# EAGLE design Modul PCB (EAGLE 9.6.2)
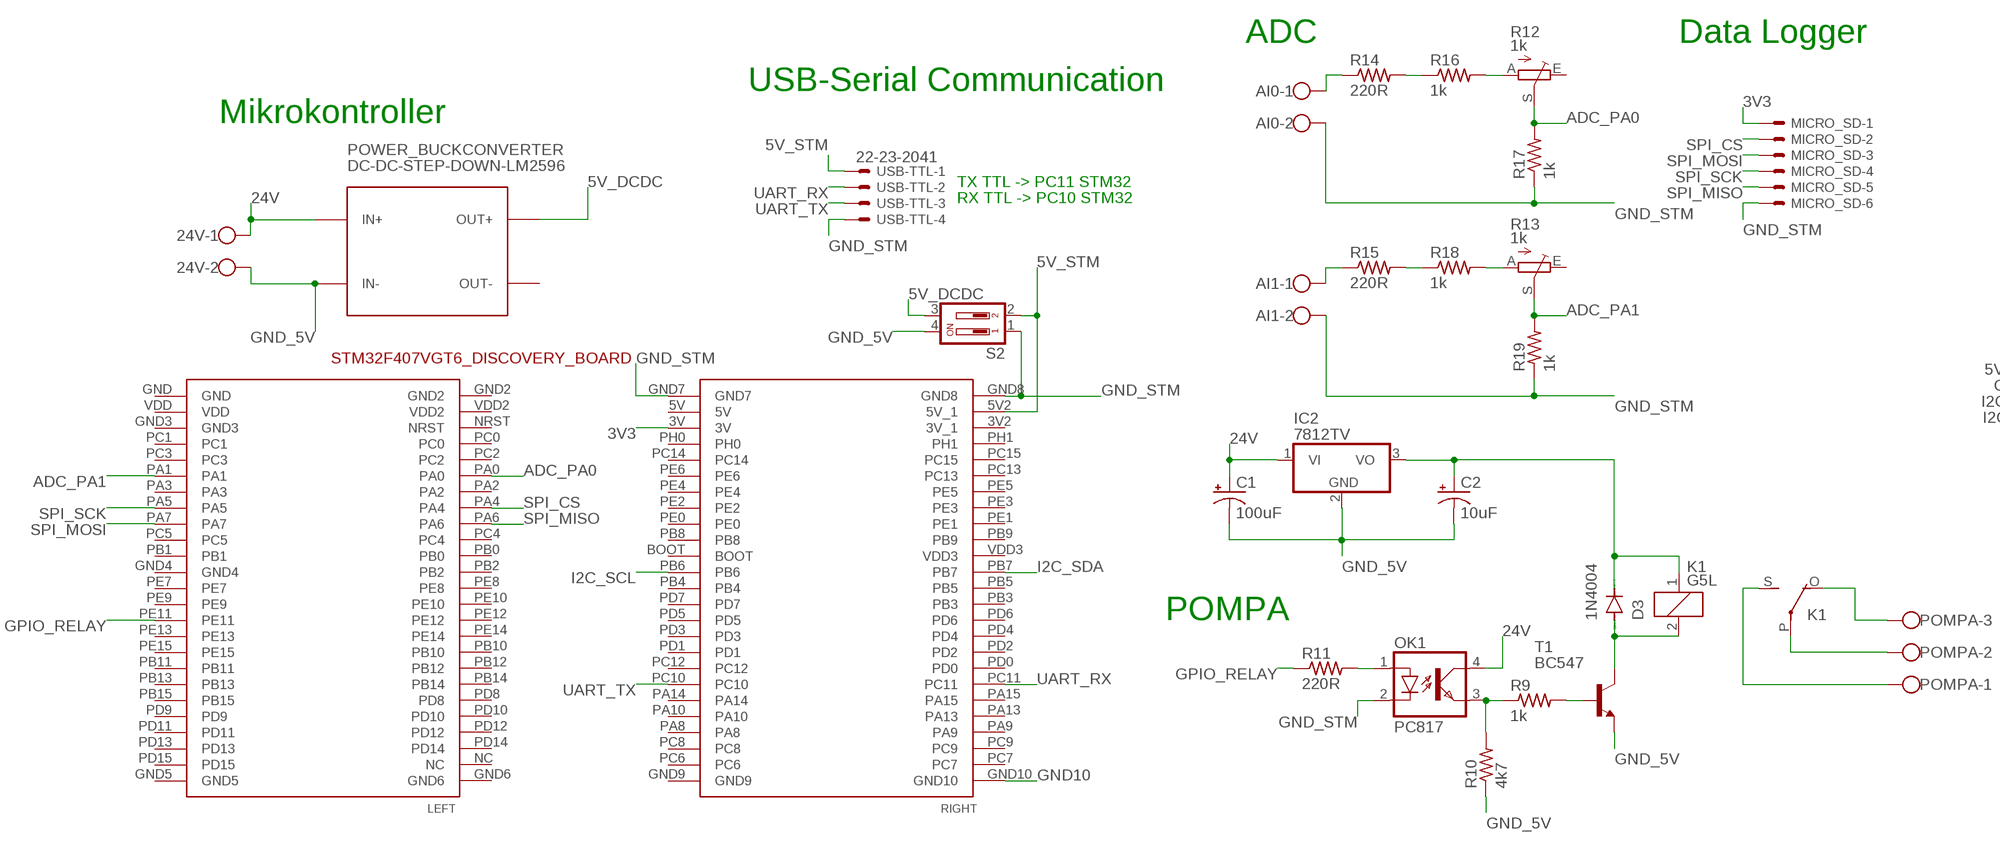
[diagram p0: schematic, sheet 1, part 1 of 2]
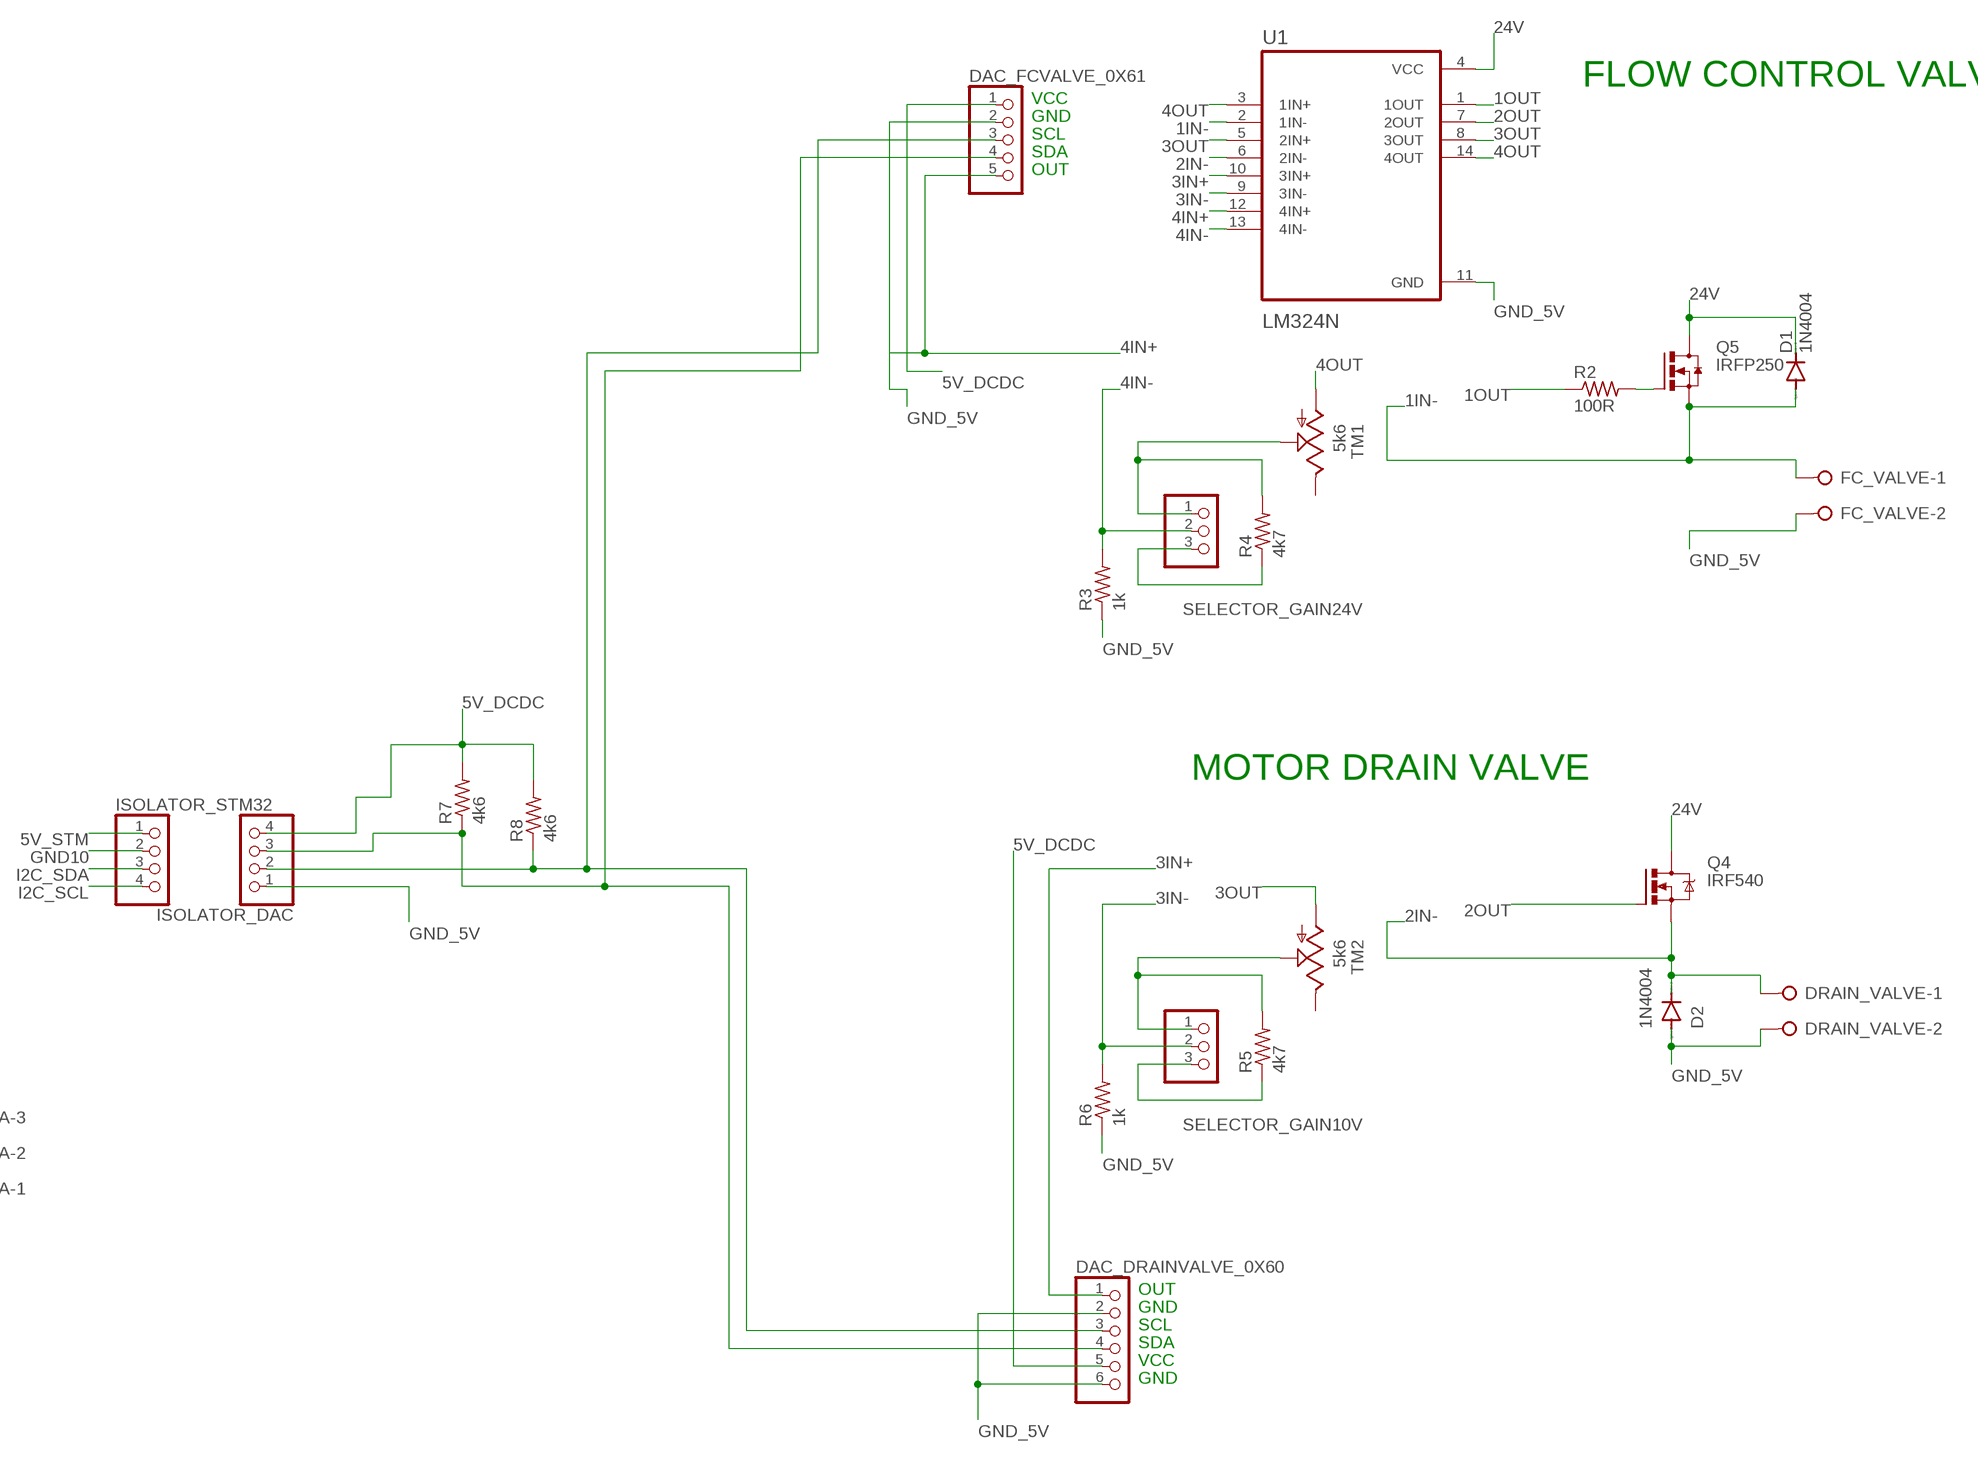
[diagram p1: schematic, sheet 1, part 2 of 2]

## Parts
24V  W237-102  [W237-102]
AI0  W237-102  [W237-102]
AI1  W237-102  [W237-102]
C1  100uF  CPOL-USE2.5-6  [E2,5-6]
C2  10uF  CPOL-USE2.5-6  [E2,5-6]
D1  1N4004  [DO41-10]
D2  1N4004  [DO41-10]
D3  1N4004  [DO41-10]
DAC_DRAINVALVE_0X60  PINHD-1X6  [1X06]
DAC_FCVALVE_0X61  PINHD-1X5  [1X05]
DRAIN_VALVE  W237-02P  [W237-132]
FC_VALVE  W237-02P  [W237-132]
IC2  7812TV  [TO220V]
ISOLATOR_DAC  PINHD-1X4  [1X04]
ISOLATOR_STM32  PINHD-1X4  [1X04]
K1  G5L  [G5LE]
MICRO_SD  22-23-2061  [22-23-2061]
OK1  PC817  [DIL04]
POMPA  W237-103  [W237-103]
POWER_BUCKCONVERTER  DC-DC-STEP-DOWN-LM2596  [DC-DC-STEP-DOWN-LM2596]
Q4  IRF540  [TO220BV]
Q5  IRFP250  [TO-247AD-V]
R2  100R  R-US_0207/10  [0207/10]
R3  1k  R-US_0207/10  [0207/10]
R4  4k7  R-US_0207/10  [0207/10]
R5  4k7  R-US_0207/10  [0207/10]
R6  1k  R-US_0207/10  [0207/10]
R7  4k6  R-US_0207/10  [0207/10]
R8  4k6  R-US_0207/10  [0207/10]
R9  1k  R-US_0207/10  [0207/10]
R10  4k7  R-US_0207/10  [0207/10]
R11  220R  R-US_0207/10  [0207/10]
R12  1k  TRIM_EU-RJ9W  [RJ9W]
R13  1k  TRIM_EU-RJ9W  [RJ9W]
R14  220R  R-US_0207/10  [0207/10]
R15  220R  R-US_0207/10  [0207/10]
R16  1k  R-US_0207/10  [0207/10]
R17  1k  R-US_0207/10  [0207/10]
R18  1k  R-US_0207/10  [0207/10]
R19  1k  R-US_0207/10  [0207/10]
S2  DS02  [DS-02]
SELECTOR_GAIN10V  PINHD-1X3  [1X03]
SELECTOR_GAIN24V  PINHD-1X3  [1X03]
STM32F407VGT6_DISCOVERY_BOARD  STM32F4-DISCOVERY  [STM32F407VG]
T1  BC547  [TO92]
TM1  5k6  TRIM  [6MM]
TM2  5k6  TRIM  [6MM]
U1  LM324N  [DIP794W45P254L1969H508Q14]
USB-TTL  22-23-2041  [22-23-2041]

## Nets
1IN-: D1.A FC_VALVE.1 Q5.S U1.2(1IN-)
1OUT: R2.1 U1.1(1OUT)
2IN-: D2.C DRAIN_VALVE.1 Q4.S U1.6(2IN-)
2OUT: Q4.G U1.7(2OUT)
3IN+: DAC_DRAINVALVE_0X60.1 U1.10(3IN+)
3IN-: R6.2 SELECTOR_GAIN10V.2 U1.9(3IN-)
3OUT: TM2.A U1.5(2IN+) U1.8(3OUT)
3V3: MICRO_SD.1 STM32F407VGT6_DISCOVERY_BOARD.3V
4IN+: DAC_FCVALVE_0X61.5 U1.12(4IN+)
4IN-: R3.2 SELECTOR_GAIN24V.2 U1.13(4IN-)
4OUT: TM1.A U1.3(1IN+) U1.14(4OUT)
5V_DCDC: DAC_DRAINVALVE_0X60.5 DAC_FCVALVE_0X61.1 ISOLATOR_DAC.4 POWER_BUCKCONVERTER.OUT+ R7.2 R8.2 S2.3
5V_STM: ISOLATOR_STM32.1 S2.2 STM32F407VGT6_DISCOVERY_BOARD.5V2(5V_1) USB-TTL.1
24V: 24V.1 C1.+ D1.C IC2.1(VI) OK1.4(COL) POWER_BUCKCONVERTER.IN+ Q4.D Q5.D U1.4(VCC)
ADC_PA0: R12.S R17.2 STM32F407VGT6_DISCOVERY_BOARD.PA0
ADC_PA1: R13.S R19.2 STM32F407VGT6_DISCOVERY_BOARD.PA1
GND10: ISOLATOR_STM32.2 STM32F407VGT6_DISCOVERY_BOARD.GND10
GND_5V: 24V.2 C1.- C2.- D2.A DAC_DRAINVALVE_0X60.2 DAC_DRAINVALVE_0X60.6 DAC_FCVALVE_0X61.2 DRAIN_VALVE.2 FC_VALVE.2 IC2.2(GND) ISOLATOR_DAC.1 POWER_BUCKCONVERTER.IN- R3.1 R6.1 R10.1 S2.4 T1.1(E) U1.11(GND)
GND_STM: AI0.2 AI1.2 MICRO_SD.6 OK1.2(C) R17.1 R19.1 S2.1 STM32F407VGT6_DISCOVERY_BOARD.GND7 STM32F407VGT6_DISCOVERY_BOARD.GND8 USB-TTL.4
GPIO_RELAY: R11.1 STM32F407VGT6_DISCOVERY_BOARD.PE11
I2C_SCL: ISOLATOR_STM32.4 STM32F407VGT6_DISCOVERY_BOARD.PB6
I2C_SDA: ISOLATOR_STM32.3 STM32F407VGT6_DISCOVERY_BOARD.PB7
N$4: Q5.G R2.2
N$9: R4.1 SELECTOR_GAIN24V.3
N$10: R4.2 SELECTOR_GAIN24V.1 TM1.S
N$11: R5.2 SELECTOR_GAIN10V.1 TM2.S
N$13: R5.1 SELECTOR_GAIN10V.3
N$16: R9.2 T1.2(B)
N$19: DAC_DRAINVALVE_0X60.4 DAC_FCVALVE_0X61.4 ISOLATOR_DAC.3 R7.1
N$20: DAC_DRAINVALVE_0X60.3 DAC_FCVALVE_0X61.3 ISOLATOR_DAC.2 R8.1
N$21: D3.A K1.2 T1.3(C)
N$23: OK1.3(EMIT) R9.1 R10.2
N$24: K1.P(2:P) POMPA.2
N$25: K1.S(2:S) POMPA.1
N$26: K1.O(2:O) POMPA.3
N$27: OK1.1(A) R11.2
N$28: AI0.1 R14.1
N$29: R14.2 R16.1
N$30: R12.A R16.2
N$32: AI1.1 R15.1
N$34: R15.2 R18.1
N$35: R13.A R18.2
N$36: C2.+ D3.C IC2.3(VO) K1.1
SPI_CS: MICRO_SD.2 STM32F407VGT6_DISCOVERY_BOARD.PA4
SPI_MISO: MICRO_SD.5 STM32F407VGT6_DISCOVERY_BOARD.PA6
SPI_MOSI: MICRO_SD.3 STM32F407VGT6_DISCOVERY_BOARD.PA7
SPI_SCK: MICRO_SD.4 STM32F407VGT6_DISCOVERY_BOARD.PA5
UART_RX: STM32F407VGT6_DISCOVERY_BOARD.PC11 USB-TTL.2
UART_TX: STM32F407VGT6_DISCOVERY_BOARD.PC10 USB-TTL.3
Unconnected: POWER_BUCKCONVERTER.OUT- R12.E R13.E STM32F407VGT6_DISCOVERY_BOARD.3V2(3V_1) STM32F407VGT6_DISCOVERY_BOARD.5V STM32F407VGT6_DISCOVERY_BOARD.BOOT STM32F407VGT6_DISCOVERY_BOARD.GND STM32F407VGT6_DISCOVERY_BOARD.GND2 STM32F407VGT6_DISCOVERY_BOARD.GND3 STM32F407VGT6_DISCOVERY_BOARD.GND4 STM32F407VGT6_DISCOVERY_BOARD.GND5 STM32F407VGT6_DISCOVERY_BOARD.GND6 STM32F407VGT6_DISCOVERY_BOARD.GND9 STM32F407VGT6_DISCOVERY_BOARD.NC STM32F407VGT6_DISCOVERY_BOARD.NRST STM32F407VGT6_DISCOVERY_BOARD.PA2 STM32F407VGT6_DISCOVERY_BOARD.PA3 STM32F407VGT6_DISCOVERY_BOARD.PA8 STM32F407VGT6_DISCOVERY_BOARD.PA9 STM32F407VGT6_DISCOVERY_BOARD.PA10 STM32F407VGT6_DISCOVERY_BOARD.PA13 STM32F407VGT6_DISCOVERY_BOARD.PA14 STM32F407VGT6_DISCOVERY_BOARD.PA15 STM32F407VGT6_DISCOVERY_BOARD.PB0 STM32F407VGT6_DISCOVERY_BOARD.PB1 STM32F407VGT6_DISCOVERY_BOARD.PB2 STM32F407VGT6_DISCOVERY_BOARD.PB3 STM32F407VGT6_DISCOVERY_BOARD.PB4 STM32F407VGT6_DISCOVERY_BOARD.PB5 STM32F407VGT6_DISCOVERY_BOARD.PB8 STM32F407VGT6_DISCOVERY_BOARD.PB9 STM32F407VGT6_DISCOVERY_BOARD.PB10 STM32F407VGT6_DISCOVERY_BOARD.PB11 STM32F407VGT6_DISCOVERY_BOARD.PB12 STM32F407VGT6_DISCOVERY_BOARD.PB13 STM32F407VGT6_DISCOVERY_BOARD.PB14 STM32F407VGT6_DISCOVERY_BOARD.PB15 STM32F407VGT6_DISCOVERY_BOARD.PC0 STM32F407VGT6_DISCOVERY_BOARD.PC1 STM32F407VGT6_DISCOVERY_BOARD.PC2 STM32F407VGT6_DISCOVERY_BOARD.PC3 STM32F407VGT6_DISCOVERY_BOARD.PC4 STM32F407VGT6_DISCOVERY_BOARD.PC5 STM32F407VGT6_DISCOVERY_BOARD.PC6 STM32F407VGT6_DISCOVERY_BOARD.PC7 STM32F407VGT6_DISCOVERY_BOARD.PC8 STM32F407VGT6_DISCOVERY_BOARD.PC9 STM32F407VGT6_DISCOVERY_BOARD.PC12 STM32F407VGT6_DISCOVERY_BOARD.PC13 STM32F407VGT6_DISCOVERY_BOARD.PC14 STM32F407VGT6_DISCOVERY_BOARD.PC15 STM32F407VGT6_DISCOVERY_BOARD.PD0 STM32F407VGT6_DISCOVERY_BOARD.PD1 STM32F407VGT6_DISCOVERY_BOARD.PD2 STM32F407VGT6_DISCOVERY_BOARD.PD3 STM32F407VGT6_DISCOVERY_BOARD.PD4 STM32F407VGT6_DISCOVERY_BOARD.PD5 STM32F407VGT6_DISCOVERY_BOARD.PD6 STM32F407VGT6_DISCOVERY_BOARD.PD7 STM32F407VGT6_DISCOVERY_BOARD.PD8 STM32F407VGT6_DISCOVERY_BOARD.PD9 STM32F407VGT6_DISCOVERY_BOARD.PD10 STM32F407VGT6_DISCOVERY_BOARD.PD11 STM32F407VGT6_DISCOVERY_BOARD.PD12 STM32F407VGT6_DISCOVERY_BOARD.PD13 STM32F407VGT6_DISCOVERY_BOARD.PD14 STM32F407VGT6_DISCOVERY_BOARD.PD15 STM32F407VGT6_DISCOVERY_BOARD.PE0 STM32F407VGT6_DISCOVERY_BOARD.PE1 STM32F407VGT6_DISCOVERY_BOARD.PE2 STM32F407VGT6_DISCOVERY_BOARD.PE3 STM32F407VGT6_DISCOVERY_BOARD.PE4 STM32F407VGT6_DISCOVERY_BOARD.PE5 STM32F407VGT6_DISCOVERY_BOARD.PE6 STM32F407VGT6_DISCOVERY_BOARD.PE7 STM32F407VGT6_DISCOVERY_BOARD.PE8 STM32F407VGT6_DISCOVERY_BOARD.PE9 STM32F407VGT6_DISCOVERY_BOARD.PE10 STM32F407VGT6_DISCOVERY_BOARD.PE12 STM32F407VGT6_DISCOVERY_BOARD.PE13 STM32F407VGT6_DISCOVERY_BOARD.PE14 STM32F407VGT6_DISCOVERY_BOARD.PE15 STM32F407VGT6_DISCOVERY_BOARD.PH0 STM32F407VGT6_DISCOVERY_BOARD.PH1 STM32F407VGT6_DISCOVERY_BOARD.VDD STM32F407VGT6_DISCOVERY_BOARD.VDD2 STM32F407VGT6_DISCOVERY_BOARD.VDD3 TM1.E TM2.E

## Notes on the sheet
- FLOW CONTROL VALVE
- VCC
- GND
- SCL
- SDA
- OUT
- ADC | Data Logger
- USB-Serial Communication
- Mikrokontroller
- TX TTL -> PC11 STM32
- RX TTL -> PC10 STM32
- MOTOR DRAIN VALVE
- POMPA
- OUT
- GND
- SCL
- SDA
- VCC
- GND

## Library data of the parts
24V AI0 AI1 = con-wago-500:W237-102: WAGO SCREW CLAMP; MPN: 237-102; OC_FARNELL: unknown; OC_NEWARK: 70K9898
C1 C2 = rcl:CPOL-US: POLARIZED CAPACITOR, American symbol; SPICEPREFIX: C
D1-D3 = diode:1N4004: DIODE general purpose rectifier, 1 A
DAC_DRAINVALVE_0X60 = pinhead:PINHD-1X6: PIN HEADER
DAC_FCVALVE_0X61 = pinhead:PINHD-1X5: PIN HEADER
DRAIN_VALVE FC_VALVE = con-wago-508:W237-02P: WAGO SREW CLAMP; OC_FARNELL: unknown; OC_NEWARK: unknown
IC2 = linear:78*: Positive VOLTAGE REGULATOR Source: http://cache.national.com/ds/LM/LM78L05.pdf http://www.fairchildsemi.com/ds/LM/LM7805.pdf
ISOLATOR_DAC ISOLATOR_STM32 = pinhead:PINHD-1X4: PIN HEADER
K1 = relay:G5L: RELAY 1 x switch, 10 A/120 V AC, 8 A/30 V ADC, Omron; OC_FARNELL: unknown; OC_NEWARK: unknown
MICRO_SD = con-molex:22-23-2061: .100" (2.54mm) Center Header - 6 Pin; MF: MOLEX; MPN: 22-23-2061; OC_FARNELL: 1462922; OC_NEWARK: 27C1933
OK1 = optocoupler:PC817: SHARP OPTO COUPLER; MPN: PC817X4J000F; OC_FARNELL: 9707727; OC_NEWARK: 97K7059
POMPA = con-wago-500:W237-103: WAGO SCREW CLAMP; MPN: 237-103; OC_FARNELL: unknown; OC_NEWARK: 18M7116
POWER_BUCKCONVERTER = diy-modules:DC-DC-STEP-DOWN-LM2596: DC/DC Step-Down Regulator based on LM2596-ADJ chip LM2596 datasheet available here: http://www.ti.com/lit/ds/symlink/lm2596.pdf Click here to find device on ebay.com <http://www.ebay.com/sch/lm2596+power+regulator>
Q4 = transistor-power:IRF540: HEXFET Power MOSFET
Q5 = transistor-power:IRFP25*: 33A/27A, 200V/150V, 0.085/0.012 Ohm, N-Channel Power MOSFET Source: Fairchild Semiconductor Corporation
R2-R11 R14-R19 = rcl:R-US_: RESISTOR, American symbol; SPICEPREFIX: R
R12 R13 = pot:TRIM_EU-: POTENTIOMETER
S2 = switch-dil:DS02: DIL/CODE SWITCH; OC_FARNELL: 9472126; OC_NEWARK: unknown
SELECTOR_GAIN10V SELECTOR_GAIN24V = pinhead:PINHD-1X3: PIN HEADER
STM32F407VGT6_DISCOVERY_BOARD = STM32F4 DISCOVERY:STM32F4-DISCOVERY: STM32F4DISCOVERY STM32F407VG Create by Jairo Reyes Email: jairo.314@hotmail.com
T1 = transistor:BC547: NPN TRANSISTOR
TM1 TM2 = adafruit:TRIM
U1 = LM324N:LM324N: Check availability <https://pricing.snapeda.com/parts/LM324N/STMicroelectronics/view-part?ref=eda>; AVAILABILITY: In Stock; DESCRIPTION: General Purpose Amplifier 4 Circuit - 14-DIP; MF: STMicroelectronics; MP: LM324N; PACKAGE: DIP-14 STMicroelectronics; PRICE: None; PURCHASE-URL: https://pricing.snapeda.com/search/part/LM324N/?ref=eda
USB-TTL = con-molex:22-23-2041: .100" (2.54mm) Center Header - 4 Pin; MF: MOLEX; MPN: 22-23-2041; OC_FARNELL: 1462920; OC_NEWARK: 38C0355

## Board
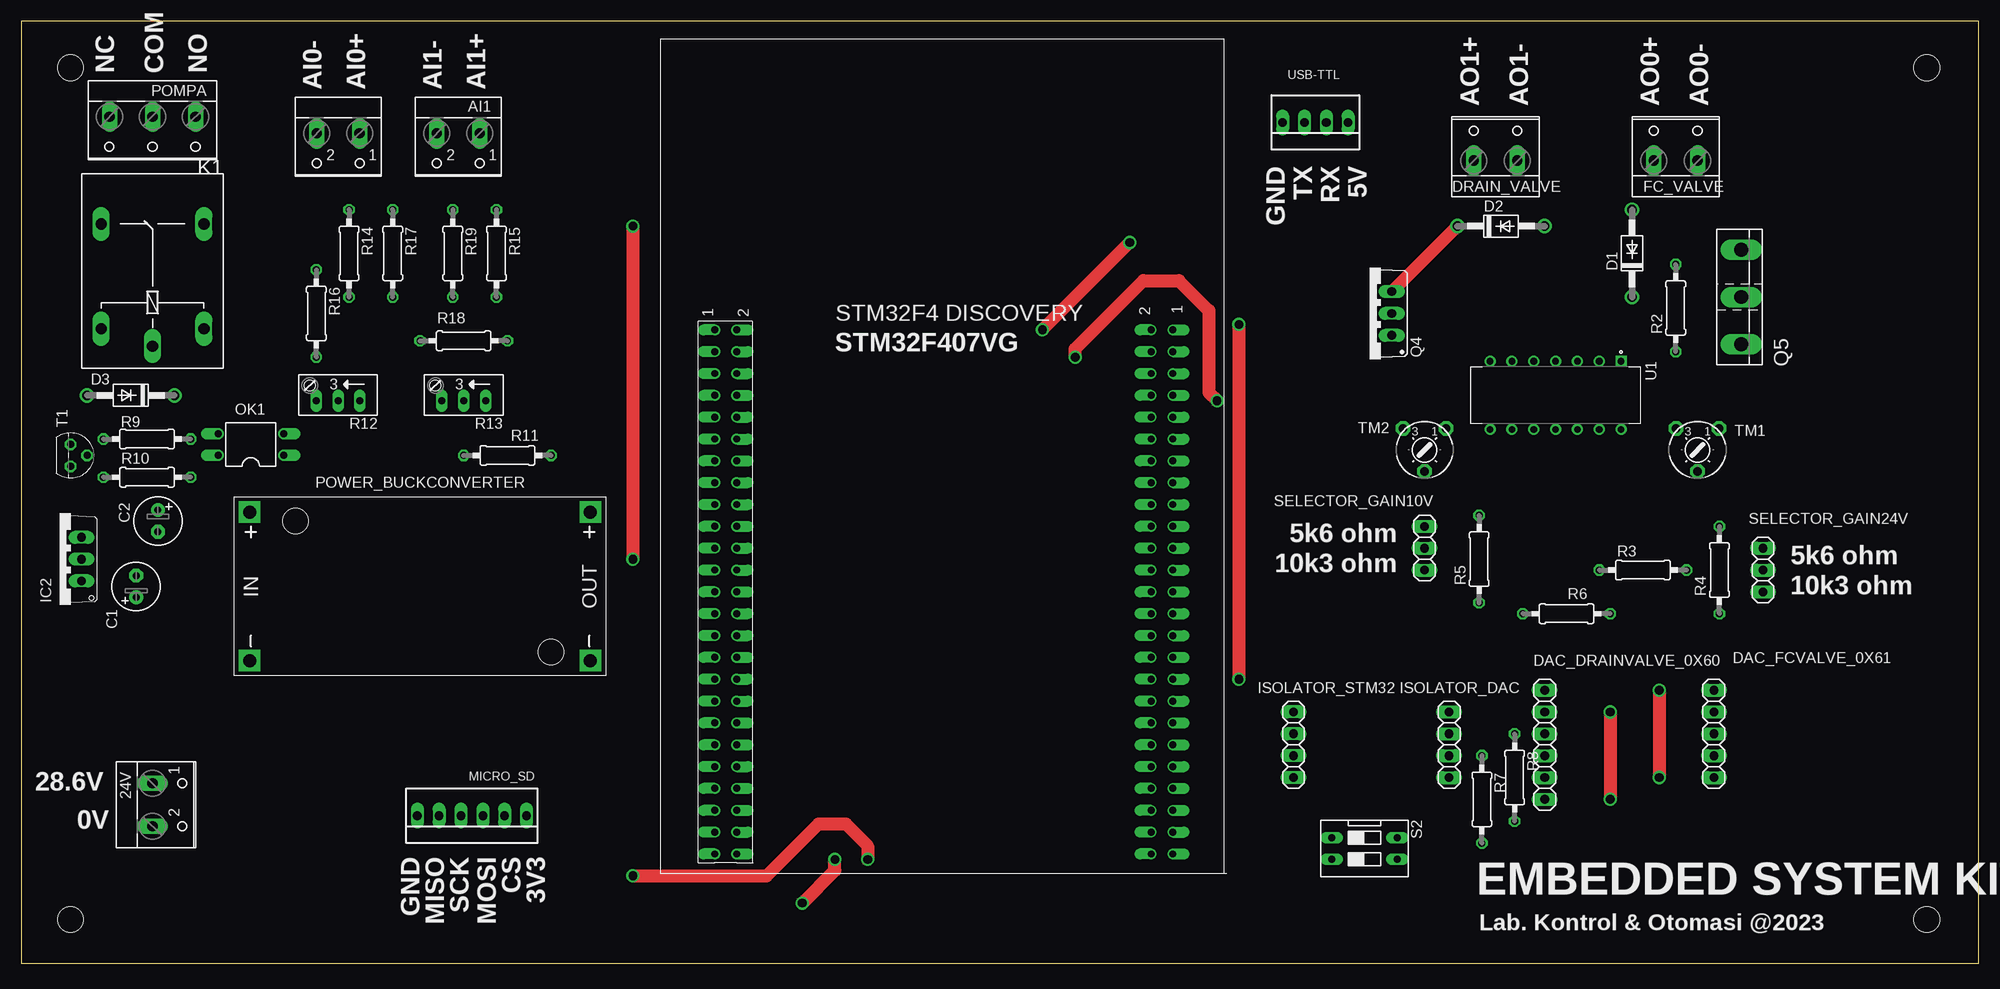
[diagram p2: board, top side]
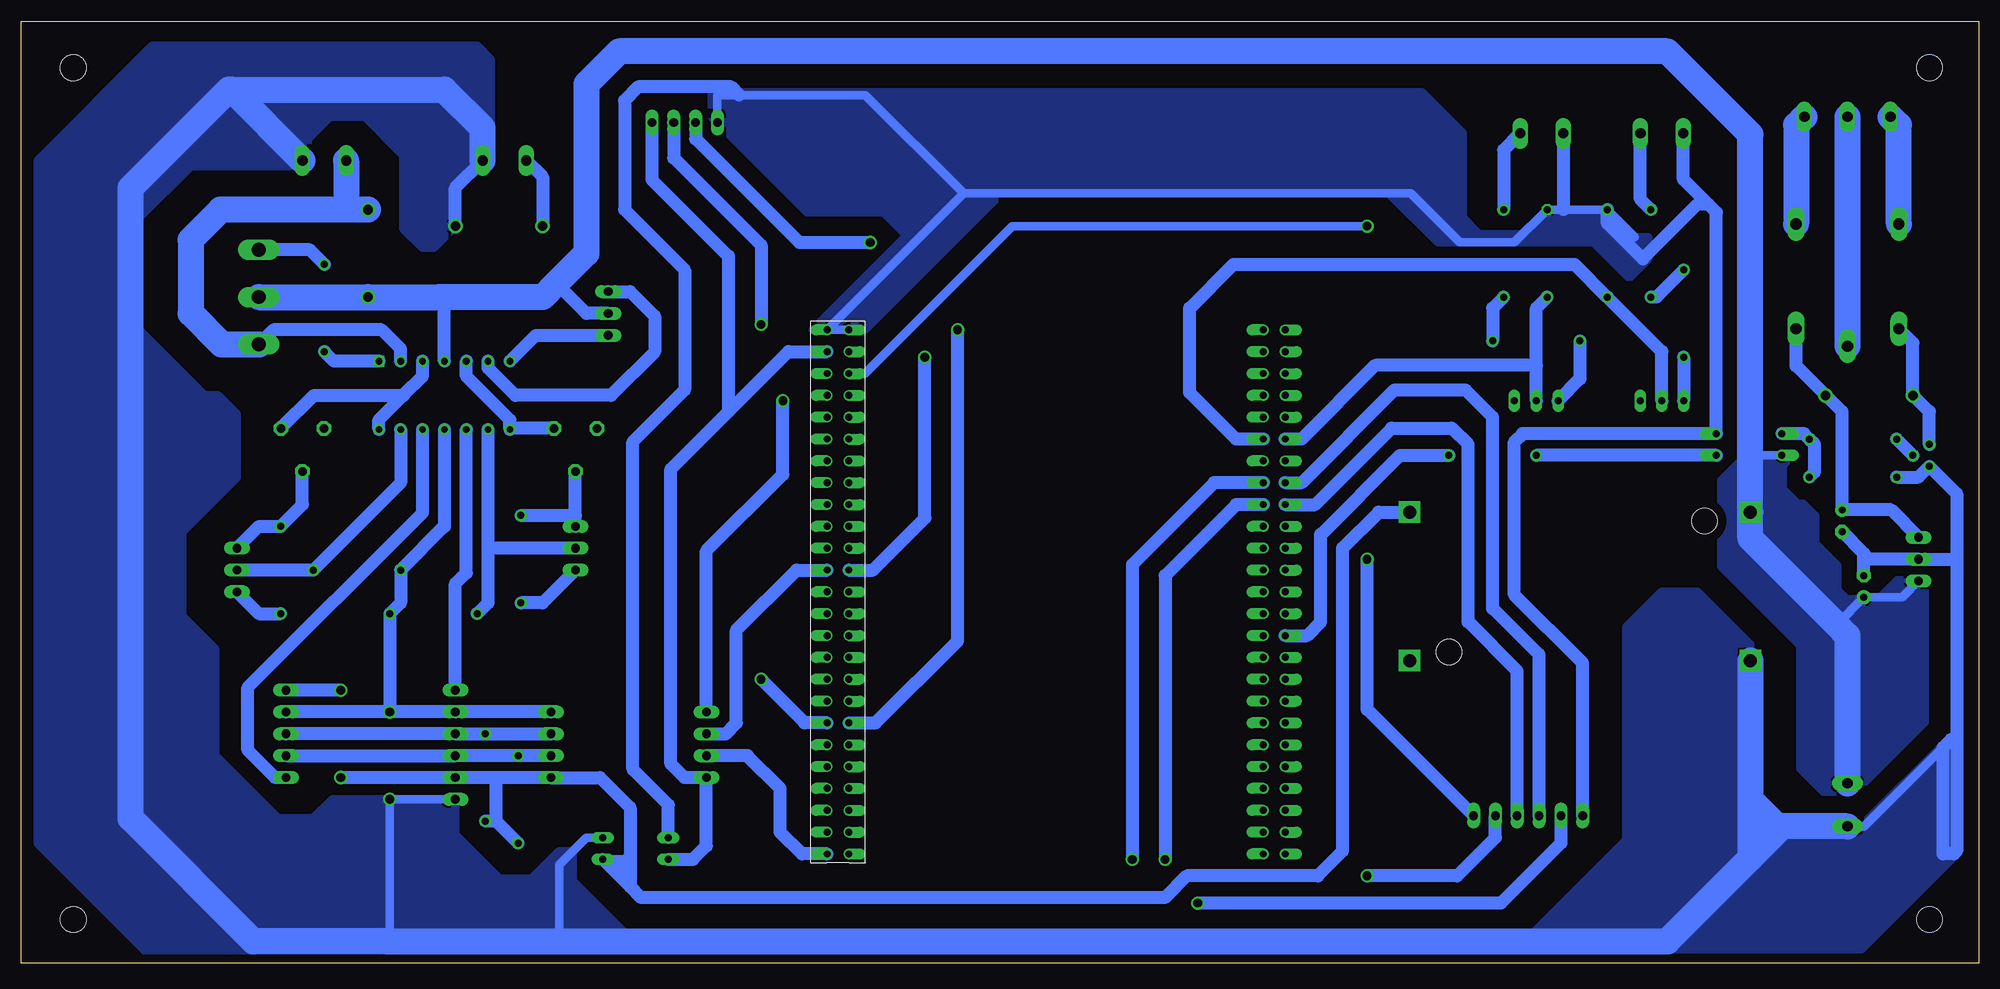
[diagram p3: board, bottom side, seen from below]

Size 227.63 x 109.52 mm. Coordinates in mm from the lower left corner, seen from the top.
Outline: 0,0 227.63,0 227.63,109.52 0,109.52 0,0
Copper layers (1*16): Top 0.035mm / dielectric 1.5mm / Bottom 0.035mm
Design rules "default": minimum track width 6mil, minimum drill 0.35mm, track to track 6mil, track to pad 6mil, pad to pad 6mil, via to via 6mil, smd to smd 6mil, copper to edge 40mil, drill to drill 6mil, minimum pad ring 10mil, minimum via ring 8mil, stop-mask expansion 4mil, vias tented up to drill 0mil, thermal gap 10mil
Holes 3 mm at 5.71,5.08 5.71,104.14 221.62,5.08 221.62,104.14

### Footprints (pad centres in the part's own frame; a part is rotated, then mirrored left to right if it is on the bottom)
W237-102 = drill 1.194 long: 1 -2.5,-1.27; 2 2.5,-1.27
E2,5-6 = drill 0.813 pad 1.6: + -1.27,0 | drill 0.813 pad 1.6 octagon: - 1.27,0
DO41-10 = drill 1.118: A 5.08,0; C -5.08,0
1X06 = drill 1.016 long: 1 -6.35,0; 2 -3.81,0; 3 -1.27,0; 4 1.27,0; 5 3.81,0; 6 6.35,0
1X05 = drill 1.016 long: 1 -5.08,0; 2 -2.54,0; 3 0,0; 4 2.54,0; 5 5.08,0
W237-132 = drill 1.194 long: 1 -2.54,-0.635; 2 2.54,-0.635
TO220V = drill 1.016 long: 1 -2.54,-2.54; 2 0,-2.54; 3 2.54,-2.54
1X04 = drill 1.016 long: 1 -3.81,0; 2 -1.27,0; 3 1.27,0; 4 3.81,0
G5LE = drill 1.321 long: 1 -7.493,-5.969; 2 -7.493,5.969; O 4.699,5.969; P -9.525,0; S 4.699,-5.969
22-23-2061 = drill 1 long: 1 -6.35,0; 2 -3.81,0; 3 -1.27,0; 4 1.27,0; 5 3.81,0; 6 6.35,0
DIL04 = drill 0.813 offset: 1 -1.27,-3.81; 2 1.27,-3.81; 3 1.27,3.81; 4 -1.27,3.81
W237-103 = drill 1.194 long: 1 -5,-1.29; 2 0,-1.29; 3 5,-1.29
DC-DC-STEP-DOWN-LM2596 = drill 1.5 pad 2.5 square: IN+ -19.812,8.636; IN- -19.812,-8.636; OUT+ 19.812,8.636; OUT- 19.812,-8.636 | hole 3: -14.478,7.62; 15.24,-7.62
TO220BV = drill 1.016 long: D 0,-2.54; G -2.54,-2.54; S 2.54,-2.54
TO-247AD-V = drill 1.6 long: D 0,-2.54; G -5.5,-2.54; S 5.5,-2.54
0207/10 = drill 0.813 octagon: 1 -5.08,0; 2 5.08,0
RJ9W = drill 0.813 long: A 2.54,0.635; E -2.54,0.635; S 0,0.635
DS-02 = drill 0.813 long: 1 -1.27,-3.81; 2 1.27,-3.81; 3 1.27,3.81; 4 -1.27,3.81
1X03 = drill 1.016 long: 1 -2.54,0; 2 0,0; 3 2.54,0
STM32F407VG = drill 0.8 pad 1.27 offset: 3V 50.74,55.88; 3V2 53.28,55.88; 5V 50.74,58.42; 5V2 53.28,58.42; BOOT 50.74,35.56; GND 0,60.96; GND2 2.54,60.96; GND3 0,55.88; GND4 0,33.02; GND5 0,0; GND6 2.54,0; GND7 50.74,60.96; GND8 53.28,60.96; GND9 50.74,0; GND10 53.28,0; NC 2.54,2.54; NRST 2.54,55.88; PA0 2.54,48.26; PA1 0,48.26; PA2 2.54,45.72; PA3 0,45.72; PA4 2.54,43.18; PA5 0,43.18; PA6 2.54,40.64; PA7 0,40.64; PA8 50.74,7.62; PA9 53.28,7.62; PA10 50.74,10.16; PA13 53.28,10.16; PA14 50.74,12.7; PA15 53.28,12.7; PB0 2.54,35.56; PB1 0,35.56; PB2 2.54,33.02; PB3 53.28,27.94; PB4 50.74,30.48; PB5 53.28,30.48; PB6 50.74,33.02; PB7 53.28,33.02; PB8 50.74,38.1; PB9 53.28,38.1; PB10 2.54,20.32; PB11 0,17.78; PB12 2.54,17.78; PB13 0,15.24; PB14 2.54,15.24; PB15 0,12.7; PC0 2.54,53.34; PC1 0,53.34; PC2 2.54,50.8; PC3 0,50.8; PC4 2.54,38.1; PC5 0,38.1; PC6 50.74,2.54; PC7 53.28,2.54; PC8 50.74,5.08; PC9 53.28,5.08; PC10 50.74,15.24; PC11 53.28,15.24; PC12 50.74,17.78; PC13 53.28,48.26; PC14 50.74,50.8; PC15 53.28,50.8; PD0 53.28,17.78; PD1 50.74,20.32; PD2 53.28,20.32; PD3 50.74,22.86; PD4 53.28,22.86; PD5 50.74,25.4; PD6 53.28,25.4; PD7 50.74,27.94; PD8 2.54,12.7; PD9 0,10.16; PD10 2.54,10.16; PD11 0,7.62; PD12 2.54,7.62; PD13 0,5.08; PD14 2.54,5.08; PD15 0,2.54; PE0 50.74,40.64; PE1 53.28,40.64; PE2 50.74,43.18; PE3 53.28,43.18; PE4 50.74,45.72; PE5 53.28,45.72; PE6 50.74,48.26; PE7 0,30.48; PE8 2.54,30.48; PE9 0,27.94; PE10 2.54,27.94; PE11 0,25.4; PE12 2.54,25.4; PE13 0,22.86; PE14 2.54,22.86; PE15 0,20.32; PH0 50.74,53.34; PH1 53.28,53.34; VDD 0,58.42; VDD2 2.54,58.42; VDD3 53.28,35.56
TO92 = drill 0.813 octagon: 1 1.27,0; 2 0,1.905; 3 -1.27,0
6MM = drill 1 pad 1.676 octagon: A -2.5,-2.5; E 2.5,-2.5; S 0,2.5
DIP794W45P254L1969H508Q14 = drill 0.77 pad 1.17 square: 1 -3.97,7.62 | drill 0.77 pad 1.17: 2 -3.97,5.08; 3 -3.97,2.54; 4 -3.97,0; 5 -3.97,-2.54; 6 -3.97,-5.08; 7 -3.97,-7.62; 8 3.97,-7.62; 9 3.97,-5.08; 10 3.97,-2.54; 11 3.97,0; 12 3.97,2.54; 13 3.97,5.08; 14 3.97,7.62
22-23-2041 = drill 1 long: 1 -3.81,0; 2 -1.27,0; 3 1.27,0; 4 3.81,0

### Placement (x,y rotation side)
24V  16.51,18.41 270 top
AI0  36.83,95.25 180 top
AI1  50.8,95.25 180 top
C1  13.34,43.81 90 top
C2  15.88,51.44 270 top
D1  187.33,82.55 90 top
D2  172.09,85.72 0 top
D3  12.7,66.04 180 top
DAC_DRAINVALVE_0X60  177.16,25.4 270 top
DAC_FCVALVE_0X61  196.85,26.67 270 top
DRAIN_VALVE  171.45,93.98 0 top
FC_VALVE  192.41,93.98 0 top
IC2  4.45,46.99 90 top
ISOLATOR_DAC  166.05,25.4 270 top
ISOLATOR_STM32  147.96,25.4 90 top
K1  15.24,81.28 90 top
MICRO_SD  52.39,17.14 180 top
OK1  26.67,60.33 90 top
POMPA  15.24,97.16 180 top
POWER_BUCKCONVERTER  46.36,43.81 0 top
Q4  156.84,75.56 90 top
Q5  202.56,77.47 270 top
R2  192.41,76.2 90 top
R3  188.59,45.72 0 top
R4  197.49,45.72 90 top
R5  169.55,46.99 90 top
R6  179.71,40.64 180 top
R7  169.86,19.05 270 top
R8  173.67,21.59 270 top
R9  14.61,60.96 180 top
R10  14.61,56.52 0 top
R11  56.52,59.06 180 top
R12  36.83,66.04 180 top
R13  51.44,66.04 180 top
R14  38.1,82.55 270 top
R15  55.25,82.55 270 top
R16  34.29,75.56 270 top
R17  43.18,82.55 270 top
R18  51.44,72.39 180 top
R19  50.17,82.55 270 top
S2  156.21,13.34 270 top
SELECTOR_GAIN10V  163.19,48.26 270 top
SELECTOR_GAIN24V  202.56,45.72 270 top
STM32F407VGT6_DISCOVERY_BOARD  80.65,12.7 0 top
T1  5.71,59.06 270 top
TM1  194.94,59.69 180 top
TM2  163.19,59.69 180 top
U1  178.44,66.04 270 top
USB-TTL  150.5,97.79 180 top

### Tracks (layer width: path | path; a pad name or v marks a point on that pad's centre or on a via)
1IN-
  Bottom 1.524: U1.2 183.52,71.44 185.74,73.66 198.34,73.66 Q5.S
  Bottom 3.048: Q5.S 204.37,71.97 207.96,75.56 207.96,84.14 204.47,87.63 190.18,87.63 | D1.A 190.18,87.63 | FC_VALVE.1 189.87,87.95 190.18,87.63
1OUT
  Bottom 1.524: U1.1 191.3,70.01 R2.1
2IN-
  Top 1.524: Q4.S D2.C
  Bottom 1.524: DRAIN_VALVE.1 167,91.44 D2.C | U1.6 173.35,69.22 170.18,66.04 159.07,66.04 153.99,71.12 153.99,75.25 156.84,78.1 Q4.S
2OUT
  Bottom 1.524: U1.7 167.8,73.03 Q4.G
3IN+
  Bottom 1.524: DAC_DRAINVALVE_0X60.1 177.16,44.13 175.9,45.4 U1.10
3IN-
  Bottom 1.524: SELECTOR_GAIN10V.2 173.35,48.26 | 173.35,48.26 U1.9 | R6.2 173.35,41.91 173.35,48.26
3OUT
  Bottom 1.524: TM2.A 170.69,62.19 U1.8 170.81,63.18 175.9,68.26 U1.5
3V3  (via drill 1.02 pad 1.3)
  Top 1.524: v71.12,85.72 v71.12,46.99
  Bottom 1.016: v71.12,85.72 112.4,85.72 129.54,68.58 STM32F407VGT6_DISCOVERY_BOARD.3V | MICRO_SD.1 58.74,17.46
  Bottom 1.524: MICRO_SD.1 71.12,29.53 v71.12,46.99
4IN+
  Bottom 1.524: DAC_FCVALVE_0X61.5 198.12,21.59 201.3,24.77 201.3,32.07 180.97,52.39 U1.12
4IN-
  Bottom 1.524: U1.13 183.52,55.88 R3.2 SELECTOR_GAIN24V.2
4OUT
  Bottom 1.524: U1.14 186.06,63.18 183.2,66.04 | U1.3 180.97,68.26 183.2,66.04 | TM1.A 193.59,66.04 183.2,66.04
5V_DCDC  (via drill 1.02 pad 1.3)
  Top 1.524: v190.5,31.75 v190.5,21.59
  Bottom 1.016: 158.12,12.06 157.48,12.06 | 157.48,12.06 156.84,12.7 156.84,12.06 | 156.84,12.06 156.84,10.79 | 156.84,10.79 156.84,9.53 159.38,12.06 S2.3 158.12,12.06 | 157.48,12.06 156.84,12.06 | 158.12,12.06 156.84,10.79
  Bottom 1.524: POWER_BUCKCONVERTER.OUT+ 69.79,52.45 73.98,48.26 73.98,13.02 76.84,10.16 92.08,10.16 94.62,7.62 155.58,7.62 156.84,8.89 | 156.84,8.89 S2.3 | 156.84,8.89 156.84,18.1 160.34,21.59 ISOLATOR_DAC.4 172.09,21.59 | 172.09,21.59 DAC_DRAINVALVE_0X60.5 v190.5,21.59 | R7.2 172.4,16.51 | 172.4,16.51 R8.2 | 172.4,16.51 172.4,21.27 172.09,21.59 | v190.5,31.75 DAC_FCVALVE_0X61.1
5V_STM
  Bottom 1.524: S2.2 149.54,12.06 147.96,13.65 ISOLATOR_STM32.1 150.5,21.59 152.08,23.18 152.08,57.47 145.41,64.14 | 145.41,64.14 138.43,71.12 STM32F407VGT6_DISCOVERY_BOARD.5V2 | USB-TTL.1 154.31,91.12 145.41,82.23 145.41,64.14
24V
  Bottom 1.016: IC2.1 8.89,42.55 C1.+ 16.51,39.37 | OK1.4 26.54,59.06
  Bottom 1.524: 179.07,77.47 178.44,76.83 U1.4 | Q4.D 161.93,75.56 165.42,79.06
  Bottom 3.048: 24V.1 15.24,38.1 16.51,39.37 26.54,49.4 POWER_BUCKCONVERTER.IN+ 26.54,59.06 26.54,96.39 36.2,106.05 158.12,106.05 161.93,102.23 161.93,82.55 165.42,79.06 167,77.47 179.07,77.47 D1.C Q5.D
  pour Bottom: 6.03,44.77 6.03,27.94 13.97,20 14.29,19.69 16.51,19.69 18.1,19.69 20,21.59 20.95,22.54 20.95,36.83 30.16,46.04 30.16,51.12 30.16,56.2 27.3,59.06 21.27,59.06 22.54,57.78 22.54,56.2 22.54,55.25 20.95,53.66 20.32,53.66 18.73,52.07 18.73,48.89 16.19,46.36 16.19,43.5 15.24,42.55 13.02,42.55 11.75,42.55 9.53,44.77
ADC_PA0
  Bottom 1.524: R12.S 36.83,71.12 R17.2 46.99,81.28 86.68,81.28 91.76,76.2 91.76,66.36 86.36,60.96 STM32F407VGT6_DISCOVERY_BOARD.PA0
ADC_PA1
  Bottom 1.524: R13.S 51.44,69.53 | 51.44,69.53 51.44,76.2 R19.2 | 51.44,69.53 70.17,69.53 78.74,60.96 STM32F407VGT6_DISCOVERY_BOARD.PA1
GND10
  Bottom 1.524: STM32F407VGT6_DISCOVERY_BOARD.GND10 136.84,12.7 139.38,15.24 139.38,20.32 143.19,24.13 ISOLATOR_STM32.2
GND_5V  (via drill 1.02 pad 1.3)
  Top 1.524: v184.78,29.21 v184.78,19.05
  Bottom 1.016: 25.61,35.18 POWER_BUCKCONVERTER.IN- | 3.17,26.04 13.34,15.88 15.2,15.88 24V.2 15.28,15.88 | 176.53,19.05 DAC_DRAINVALVE_0X60.6 v184.78,19.05 184.78,2.86 185.1,2.54 | S2.4 161.93,14.61 165.1,11.43 165.1,2.54
  Bottom 1.524: D2.A 177.16,90.17 DRAIN_VALVE.2 | 2.54,47.31 2.54,54.61 T1.1 6.98,56.52 R10.1 | 2.54,47.31 2.54,13.02 2.86,12.7 4.13,12.7 4.13,25.08 3.17,26.04 | 2.54,47.31 2.86,46.99 IC2.2 12.7,46.99 13.34,47.62 | 13.34,47.62 C2.- | C1.- 13.34,47.62 | v184.78,29.21 DAC_FCVALVE_0X61.2 | v184.78,29.21 DAC_DRAINVALVE_0X60.2 ISOLATOR_DAC.1 | U1.11 178.44,50.8 R3.1 183.52,41.91 R6.1 v184.78,29.21
  Bottom 3.048: DRAIN_VALVE.2 173.99,97.16 178.44,101.6 203.2,101.6 | 24V.2 22.82,15.91 | POWER_BUCKCONVERTER.IN- 26.54,19.05 | 26.54,19.05 26.54,12.19 | 26.54,12.19 36.2,2.54 165.1,2.54 185.1,2.54 200.66,2.54 214.95,16.83 214.95,90.17 203.52,101.6 203.2,101.6 | 22.82,15.91 26.54,12.19 | 22.82,15.91 23.41,15.91 26.54,19.05 | FC_VALVE.2 203.2,101.6
  pour Bottom: 35.24,2.22 24.77,16.19 35.56,2.22
  pour Bottom: 3.17,26.35 3.17,12.06 13.65,1.59 53.66,1.59 40.96,14.29 40.96,39.05 36.83,43.18 32.7,43.18 25.72,36.2 25.72,19.37 22.86,16.51 14.92,16.51 13.97,15.56
  pour Bottom: 163.51,13.02 163.51,9.53 157.48,3.49 159.7,1.27 213.04,1.27 225.74,13.97 225.74,93.34 212.41,106.68 174.62,106.68 173.04,105.09 173.04,94.3 176.85,90.49 177.16,90.49 177.16,85.72 179.71,83.19 180.97,83.19 183.2,85.41 183.2,93.98 187.64,98.42 191.77,98.42 193.68,96.52 194.31,95.88 194.31,92.71 207.96,92.71 214,86.68 214,73.66 208.28,67.94 206.38,66.04 204.79,66.04 202.56,63.82 202.56,56.52 208.91,50.17 208.91,40.32 205.1,36.51 205.1,24.13 197.8,16.83 193.68,16.83 191.45,19.05 184.47,19.05 177.48,19.05 177.16,18.73 177.16,14.92 174.31,12.06 172.09,9.84 168.28,9.84 165.1,13.02
GND_STM
  Bottom 1.016: R19.1 50.2,87.59 | R19.1 48.26,87.63 R17.1 40,84.45 | R19.1 53.97,83.82 60.33,83.82 66.04,89.53 118.05,89.53 | 118.05,89.53 STM32F407VGT6_DISCOVERY_BOARD.GND8 STM32F407VGT6_DISCOVERY_BOARD.GND7 | 118.05,89.53 129.48,100.97 144.15,100.97 146.69,100.97 USB-TTL.4
  Bottom 1.524: AI0.2 34.33,91.16 31.43,88.27 | 31.43,88.27 30.48,87.31 OK1.2 53.02,61.59 53.97,60.64 53.97,42.86 46.04,34.92 MICRO_SD.6 | 31.43,88.27 32.7,88.27 39.05,81.91 43.18,86.04 R17.1 | AI1.2 48.3,87.67 48.26,87.63 | 144.15,100.97 145.1,101.92 155.89,101.92 157.48,100.33 157.48,87.63 150.5,80.64 150.5,66.67 156.53,60.64 156.53,22.54 152.4,18.41 S2.1
  pour Bottom: 123.83,83.82 127.32,87.31 136.21,87.31 147.32,98.42 147.32,101.28 64.77,101.28 60.01,96.52 60.01,86.68 58.1,84.77 53.02,84.77 50.17,87.63 43.18,87.63 40,84.45 38.42,84.45 38.42,81.91 40.64,79.69 44.77,83.82 62.86,83.82 68.58,89.53 114.3,89.53
  pour Bottom: 120.02,85.41 120.02,84.14 130.49,73.66 135.25,73.66 123.51,85.41
  pour Bottom: 114.3,88.9 129.54,73.66 135.57,73.66 120.33,88.9
GPIO_RELAY
  Bottom 1.524: STM32F407VGT6_DISCOVERY_BOARD.PE11 78.11,38.1 76.52,39.69 76.52,49.85 67.31,59.06 R11.1
I2C_SCL  (via drill 1.02 pad 1.3)
  Top 1.524: v122.56,70.48 122.56,71.44 130.49,79.38 134.62,79.38 138.11,75.88 138.11,66.36 v139.06,65.41
  Bottom 1.524: STM32F407VGT6_DISCOVERY_BOARD.PB6 128.59,45.72 122.56,51.75 v122.56,70.48 | ISOLATOR_STM32.4 147.96,47.94 139.06,56.83 v139.06,65.41
I2C_SDA
  Bottom 1.524: ISOLATOR_STM32.3 145.73,26.67 144.46,27.94 144.46,38.73 137.48,45.72 STM32F407VGT6_DISCOVERY_BOARD.PB7
N$4
  Bottom 1.524: R2.2 194.09,82.97 Q5.G
N$9
  Bottom 1.524: SELECTOR_GAIN24V.3 200.03,40.64 R4.1
N$10
  Bottom 1.524: SELECTOR_GAIN24V.1 200.03,50.8 R4.2 194.94,53.34 TM1.S
N$11
  Bottom 1.524: SELECTOR_GAIN10V.1 163.19,52.07 | 163.19,52.07 TM2.S | R5.2 163.19,52.07
N$13
  Bottom 1.524: SELECTOR_GAIN10V.3 167,41.91 R5.1
N$16
  Bottom 1.524: T1.2 R9.2
N$19
  Bottom 1.524: DAC_FCVALVE_0X61.4 DAC_DRAINVALVE_0X60.4 R7.1 ISOLATOR_DAC.3
N$20
  Bottom 1.524: DAC_FCVALVE_0X61.3 DAC_DRAINVALVE_0X60.3 R8.1 ISOLATOR_DAC.2 165.42,26.67
N$21
  Bottom 1.016: K1.2 9.27,72.77
  Bottom 1.524: T1.3 5.71,64.14 D3.A 7.62,72.14 K1.2
N$23
  Bottom 1.524: R10.2 19.05,57.15 19.05,60.33 R9.1 20.32,61.59 OK1.3
N$24
  Bottom 3.048: POMPA.2 K1.P
N$25
  Bottom 3.048: POMPA.1 21.21,97.48 K1.S
N$26
  Bottom 3.048: K1.O 9.27,97.48 POMPA.3
N$27
  Bottom 1.524: OK1.1 R11.2
N$28
  Bottom 1.524: R14.1 39.33,88.86 AI0.1
N$29
  Bottom 1.524: R16.1 37.47,77.47 R14.2
N$30
  Bottom 1.524: R16.2 R12.A
N$32
  Bottom 1.524: AI1.1 55.25,94.58 R15.1
N$34
  Bottom 1.524: R15.2 56.52,76.2 R18.1
N$35
  Bottom 1.524: R18.2 46.36,67.94 R13.A
N$36
  Bottom 1.524: IC2.3 10.16,52.7 C2.+ 15.88,64.14 D3.C 21.21,69.47 K1.1
SPI_CS  (via drill 1.02 pad 1.3)
  Top 1.524: v71.12,10.16 86.68,10.16 92.71,16.19 95.89,16.19 98.42,13.65 v98.42,12.06
  Bottom 1.524: v71.12,10.16 60.64,10.16 56.2,14.61 MICRO_SD.2 56.2,17.78 | STM32F407VGT6_DISCOVERY_BOARD.PA4 88.9,55.88 98.42,46.36 v98.42,12.06
SPI_MISO  (via drill 1.02 pad 1.3)
  Top 1.524: v90.81,6.99 94.62,10.79 v94.62,12.06
  Bottom 1.524: MICRO_SD.5 48.58,13.97 55.56,6.99 v90.81,6.99 | STM32F407VGT6_DISCOVERY_BOARD.PA6 86.36,53.34 94.62,45.08 v94.62,12.06
SPI_MOSI
  Bottom 1.524: MICRO_SD.3 53.66,33.97 59.37,39.69 59.37,60.33 61.28,62.23 68.26,62.23 77.15,53.34 STM32F407VGT6_DISCOVERY_BOARD.PA7
SPI_SCK
  Bottom 1.016: 51.12,16.51 MICRO_SD.4
  Bottom 1.524: MICRO_SD.4 51.12,35.88 56.52,41.27 56.52,63.5 59.69,66.67 67.94,66.67 78.74,55.88 STM32F407VGT6_DISCOVERY_BOARD.PA5
UART_RX  (via drill 1.02 pad 1.3)
  Top 1.524: v141.6,74.3 v141.6,33.02
  Bottom 1.524: STM32F407VGT6_DISCOVERY_BOARD.PC11 136.53,27.94 v141.6,33.02 | USB-TTL.2 151.77,93.66 141.6,83.5 v141.6,74.3
UART_TX  (via drill 1.02 pad 1.3)
  Top 1.524: v118.75,73.66 v128.91,83.82
  Bottom 1.524: STM32F407VGT6_DISCOVERY_BOARD.PC10 128.27,27.94 118.75,37.47 v118.75,73.66 | USB-TTL.3 149.22,95.88 137.16,83.82 v128.91,83.82

### Text on the board
tPlace: NC | COM | NO | AI0- | AI0+ | AI1- | AI1+ | AO1+ | AO1- | AO0+ | AO0- | GND | TX | RX | 5V | STM32F407VG | 5k6 ohm | 10k3 ohm | 5k6 ohm | 10k3 ohm | 28.6V | 0V | GND | MISO | SCK | MOSI | CS | 3V3 | EMBEDDED SYSTEM KIT | Lab. Kontrol & Otomasi @2023